# Altium project mcuhardwarebased.PrjPcb
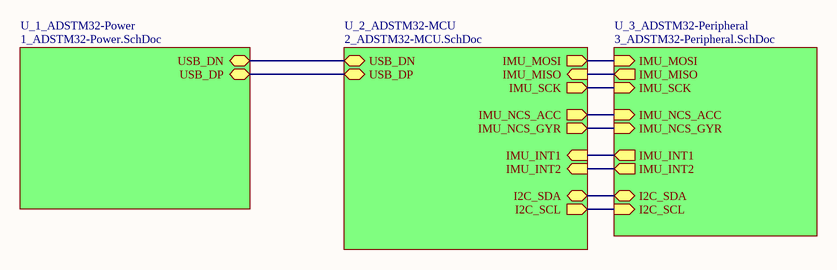
[diagram p0: 0_ADSTM32-Overview.SchDoc]
4 sheets, 30 parts. Net scope: hierarchical (ports join the sheet entries above them; power ports are global).
Board file: ADSTM32-PCB.PcbDoc
Sheets:
  0_ADSTM32-Overview.SchDoc
    U_1_ADSTM32-Power = 1_ADSTM32-Power.SchDoc
    U_2_ADSTM32-MCU = 2_ADSTM32-MCU.SchDoc
    U_3_ADSTM32-Peripheral = 3_ADSTM32-Peripheral.SchDoc

## Sheet 0_ADSTM32-Overview.SchDoc
size A; SheetNumber: 1; SheetTotal: 4

### Sub-sheets
U_1_ADSTM32-Power = 1_ADSTM32-Power.SchDoc: USB_DP (bidir), USB_DN (bidir)
U_2_ADSTM32-MCU = 2_ADSTM32-MCU.SchDoc: USB_DN (bidir), USB_DP (bidir), IMU_MISO (in), IMU_SCK (out), IMU_MOSI (out), IMU_NCS_ACC (out), IMU_NCS_GYR (out), I2C_SCL (out), I2C_SDA (bidir), IMU_INT1 (in), IMU_INT2 (in)
U_3_ADSTM32-Peripheral = 3_ADSTM32-Peripheral.SchDoc: IMU_MISO (out), IMU_SCK (in), IMU_MOSI (in), IMU_NCS_ACC (in), IMU_NCS_GYR (in), IMU_INT1 (out), IMU_INT2 (out), I2C_SCL (in), I2C_SDA (bidir)

### Nets
I2C_SCL: sheet U_2_ADSTM32-MCU/I2C_SCL, sheet U_3_ADSTM32-Peripheral/I2C_SCL
I2C_SDA: sheet U_2_ADSTM32-MCU/I2C_SDA, sheet U_3_ADSTM32-Peripheral/I2C_SDA
IMU_INT1: sheet U_2_ADSTM32-MCU/IMU_INT1, sheet U_3_ADSTM32-Peripheral/IMU_INT1
IMU_INT2: sheet U_2_ADSTM32-MCU/IMU_INT2, sheet U_3_ADSTM32-Peripheral/IMU_INT2
IMU_MISO: sheet U_2_ADSTM32-MCU/IMU_MISO, sheet U_3_ADSTM32-Peripheral/IMU_MISO
IMU_MOSI: sheet U_2_ADSTM32-MCU/IMU_MOSI, sheet U_3_ADSTM32-Peripheral/IMU_MOSI
IMU_NCS_ACC: sheet U_2_ADSTM32-MCU/IMU_NCS_ACC, sheet U_3_ADSTM32-Peripheral/IMU_NCS_ACC
IMU_NCS_GYR: sheet U_2_ADSTM32-MCU/IMU_NCS_GYR, sheet U_3_ADSTM32-Peripheral/IMU_NCS_GYR
IMU_SCK: sheet U_2_ADSTM32-MCU/IMU_SCK, sheet U_3_ADSTM32-Peripheral/IMU_SCK
USB_DN: sheet U_1_ADSTM32-Power/USB_DN, sheet U_2_ADSTM32-MCU/USB_DN
USB_DP: sheet U_1_ADSTM32-Power/USB_DP, sheet U_2_ADSTM32-MCU/USB_DP

## Sheet 1_ADSTM32-Power.SchDoc
size A; SheetNumber: 2; SheetTotal: 4
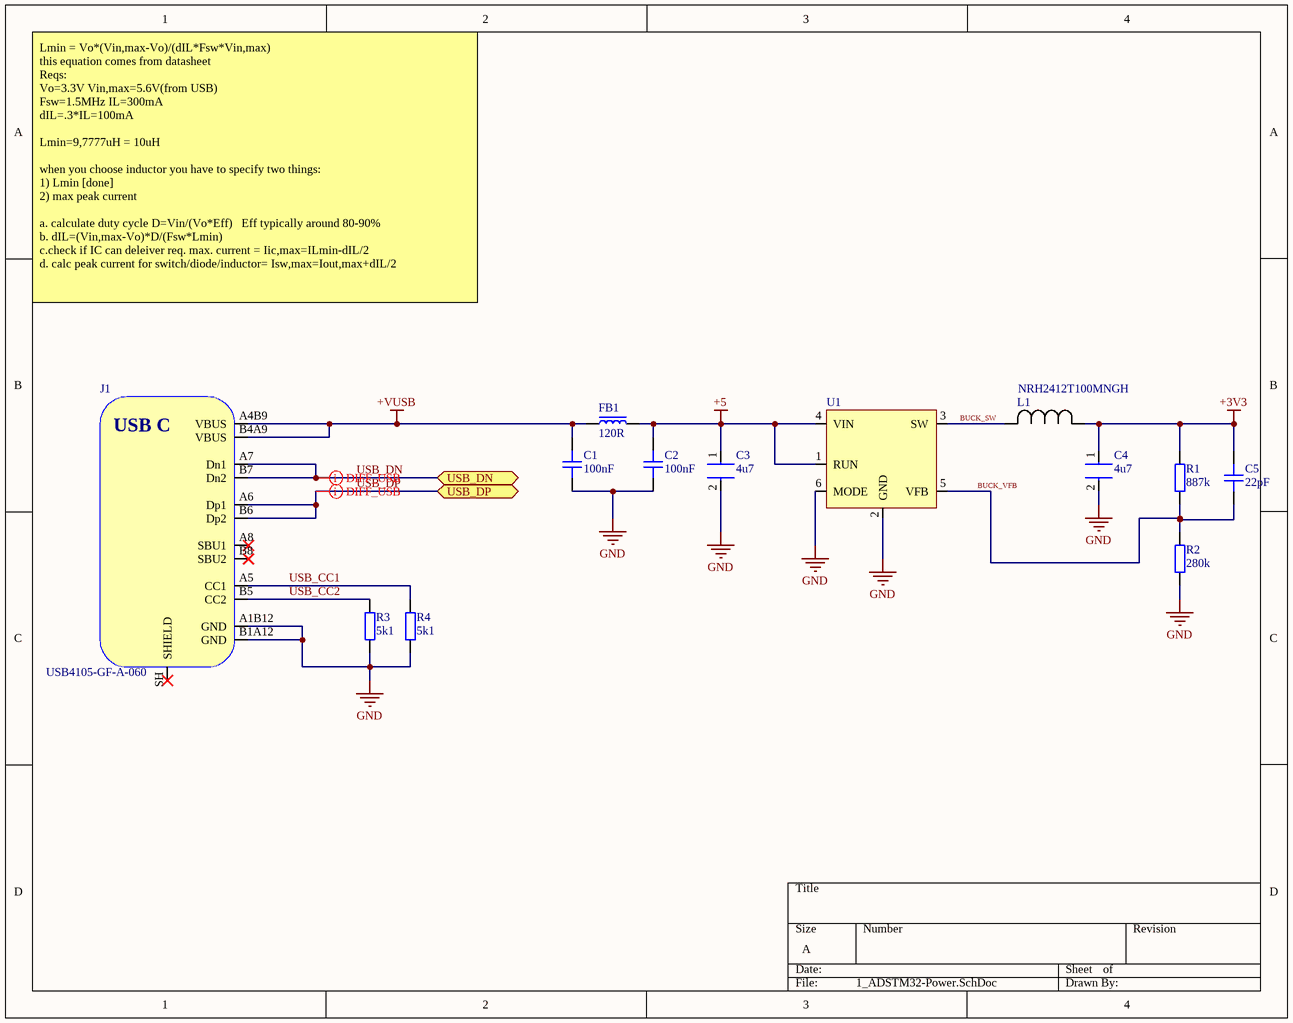
[diagram p1: 1_ADSTM32-Power.SchDoc]

### Parts
C1  100nF  [CAP_0603]
C2  100nF  [CAP_0603]
C3  4u7  [C2012X7R1C475K125AE]
C4  4u7  [C2012X7R1C475K125AE]
C5  22pF  [CAP_0603]
FB1  120R  [FB_0603]
J1  USB4105-GF-A-060  [USB4105-GF-A-060]
L1  NRH2412T100MNGH  [NRH2412T100MNGH]
R1  887k  [RES_0603]
R2  280k  [RES_0603]
R3  5k1  [RES_0603]
R4  5k1  [RES_0603]
U1  LTC3405ES6#TRMPBF  [SOT-23-6]  (value not drawn)

### Ports
USB_DN (bidir), USB_DP (bidir)

### Nets
+3V3: C4.1 C5.2 L1.1 R1.2
+5: C2.2 C3.1 FB1.2 U1.1(RUN) U1.4(VIN)
+VUSB: C1.2 FB1.1 J1.A4B9(VBUS) J1.B4A9(VBUS)
GND: C1.1 C2.1 C3.2 C4.2 J1.A1B12(GND) J1.B1A12(GND) R2.1 R3.1 R4.1 U1.2(GND) U1.6(MODE)
BUCK_SW: L1.2 U1.3(SW)
BUCK_VFB: C5.1 R1.1 R2.2 U1.5(VFB)
USB_CC1: J1.A5(CC1) R4.2
USB_CC2: J1.B5(CC2) R3.2
USB_DN: J1.A7(Dn1) J1.B7(Dn2) ; port USB_DN
USB_DP: J1.A6(Dp1) J1.B6(Dp2) ; port USB_DP

Not connected (* = marked no-connect by the designer): J1 A8(SBU1)* B8(SBU2)* SH(SHIELD)*

### Layout directives
differential pair; differential pair class DIFF_USB: USB_DN, USB_DP

### Notes on the sheet
- Lmin = Vo*(Vin,max-Vo)/(dIL*Fsw*Vin,max)
  this equation comes from datasheet
  Reqs:
  Vo=3.3V Vin,max=5.6V(from USB)
  Fsw=1.5MHz IL=300mA
  dIL=.3*IL=100mA
  Lmin=9,7777uH = 10uH
  when you choose inductor you have to specify two things:
  1) Lmin [done]
  2) max peak current
  a. calculate duty cycle D=Vin/(Vo*Eff)   Eff typically around 80-90%
  b. dIL=(Vin,max-Vo)*D/(Fsw*Lmin)
  c.check if IC can deleiver req. max. current = Iic,max=ILmin-dIL/2
  d. calc peak current for switch/diode/inductor= Isw,max=Iout,max+dIL/2
- (in symbol USB4105-GF-A-060) USB C

### Library data of the parts
C1 C2 C5 = CAP_0603: Capacitor SMD 0603; Manufacturer: *; Manufacturer Part Number: *; Distributor Link: *; LCSC: *; Rating: *; Dielectric: *
C3 C4 = CAP_0805_16V: Multilayer Ceramic Capacitors MLCC - SMD/SMT 0805 16VDC 4.7uF 10% X7R 1.25mm; Manufacturer: TDK; Manufacturer Part Number: C2012X7R1C475K125AE
FB1 = FB_0603: Ferrite Bead SMD 0603; Manufacturer: *; Manufacturer Part Number: *; Distributor Link: *; LCSC: *
J1 = USB4105-GF-A-060: USB Connector Type C SMT 12 Pin; Manufacturer: GCT; Manufacturer Part Number: USB4105-GF-A-060; Distributor Link: https://eu.mouser.com/ProductDetail/GCT/USB4105-GF-A-060?qs=QNEnbhJQKvY2mocwNJzgfA%3D%3D
L1 = NRH2412T100MNGH: Power Inductors - SMD 963-LSXNE2424MKT100M RPLCMT PN 2412 10uH 600mOhms; Manufacturer: TAIYO YUDEN; Manufacturer Part Number: NRH2412T100MNGH
R1-R4 = RES_0603: Resistor SMD 0603; Manufacturer: *; Manufacturer Part Number: *; Distributor Link: *; LCSC: *
U1 = LTC3405ES6#TRMPBF: Switching Voltage Regulators 1.5MHz, 300mA Sync Buck Reg in SOT; Manufacturer: Analog Devices; Manufacturer Part Number: LTC3405ES6#TRMPBF

## Sheet 2_ADSTM32-MCU.SchDoc
size A; SheetNumber: 3; SheetTotal: 4
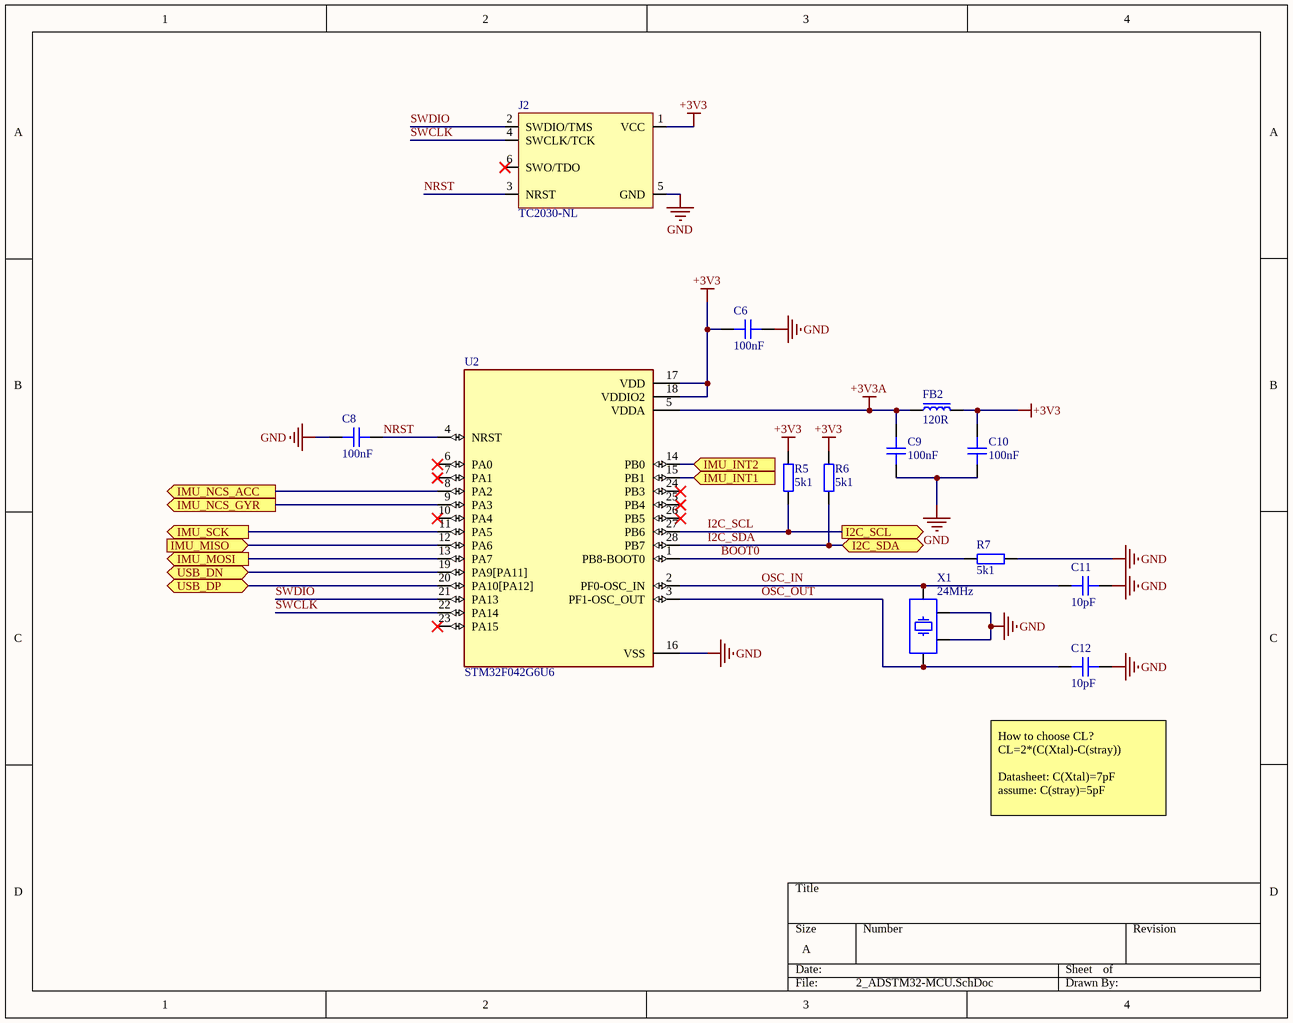
[diagram p2: 2_ADSTM32-MCU.SchDoc]

### Parts
C6  100nF  [CAP_0603]
C8  100nF  [CAP_0603]
C9  100nF  [CAP_0603]
C10  100nF  [CAP_0603]
C11  10pF  [CAP_0603]
C12  10pF  [CAP_0603]
FB2  120R  [FB_0603]
J2  TC2030-NL  [TC2030-NL-FP]  (no BOM)
R5  5k1  [RES_0603]
R6  5k1  [RES_0603]
R7  5k1  [RES_0603]
U2  STM32F042G6U6  [STM32F042G6U6]
X1  24MHz  [XTAL_3225]

### Ports
I2C_SCL (out), I2C_SDA (bidir), IMU_INT1 (in), IMU_INT2 (in), IMU_MISO (in), IMU_MOSI (out), IMU_NCS_ACC (out), IMU_NCS_GYR (out), IMU_SCK (out), USB_DN (bidir), USB_DP (bidir)

### Nets
+3V3: C6.2 C10.2 FB2.2 J2.1(VCC) R5.2 R6.2 U2.17(VDD) U2.18(VDDIO2)
+3V3A: C9.2 FB2.1 U2.5(VDDA)
GND: C6.1 C8.2 C9.1 C10.1 C11.1 C12.1 J2.5(GND) R7.1 U2.16(VSS) X1.2 X1.4
BOOT0: R7.2 U2.1(PB8-BOOT0)
I2C_SCL: R5.1 U2.27(PB6) ; port I2C_SCL
I2C_SDA: R6.1 U2.28(PB7) ; port I2C_SDA
IMU_INT1: U2.15(PB1) ; port IMU_INT1
IMU_INT2: U2.14(PB0) ; port IMU_INT2
IMU_MISO: U2.12(PA6) ; port IMU_MISO
IMU_MOSI: U2.13(PA7) ; port IMU_MOSI
IMU_NCS_ACC: U2.8(PA2) ; port IMU_NCS_ACC
IMU_NCS_GYR: U2.9(PA3) ; port IMU_NCS_GYR
IMU_SCK: U2.11(PA5) ; port IMU_SCK
NRST: C8.1 J2.3(NRST) U2.4(NRST)
OSC_IN: C11.2 U2.2(PF0-OSC_IN) X1.3
OSC_OUT: C12.2 U2.3(PF1-OSC_OUT) X1.1
SWCLK: J2.4(SWCLK/TCK) U2.22(PA14)
SWDIO: J2.2(SWDIO/TMS) U2.21(PA13)
USB_DN: U2.19(PA9[PA11]) ; port USB_DN
USB_DP: U2.20(PA10[PA12]) ; port USB_DP

Not connected (* = marked no-connect by the designer): J2 6(SWO/TDO)*; U2 6(PA0)* 7(PA1)* 10(PA4)* 23(PA15)* 24(PB3)* 25(PB4)* 26(PB5)*

### Notes on the sheet
- How to choose CL?
  CL=2*(C(Xtal)-C(stray))
  Datasheet: C(Xtal)=7pF
  assume: C(stray)=5pF

### Library data of the parts
C6 C8-C12 = CAP_0603: Capacitor SMD 0603; Manufacturer: *; Manufacturer Part Number: *; Distributor Link: *; LCSC: *; Rating: *; Dielectric: *
FB2 = FB_0603: Ferrite Bead SMD 0603; Manufacturer: *; Manufacturer Part Number: *; Distributor Link: *; LCSC: *
J2 = TC2030-NL: Tag-Connect No-Solder SWD Debug Connector (No Legs) DO NOT PLACE; Manufacturer: Tag-Connect; Manufacturer Part Number: TC2030-NL-FP
R5-R7 = RES_0603: Resistor SMD 0603; Manufacturer: *; Manufacturer Part Number: *; Distributor Link: *; LCSC: *
U2 = STM32F042G6U6: ARM® Cortex®-M0 STM32F0 Microcontroller IC 32-Bit Single-Core 48MHz 32KB (32K x 8) FLASH 28-UFQFPN (4x4); Manufacturer: STMicroelectronics; Manufacturer Part Number: STM32F042G6U6
X1 = TSX-3225_24.0000MF15X-AC: Crystal SMD 24MHz 10PPM 7pF 3225; Manufacturer: Epson; Manufacturer Part Number: TSX-3225 24.0000MF15X-AC

## Sheet 3_ADSTM32-Peripheral.SchDoc
size A; SheetNumber: 4; SheetTotal: 4
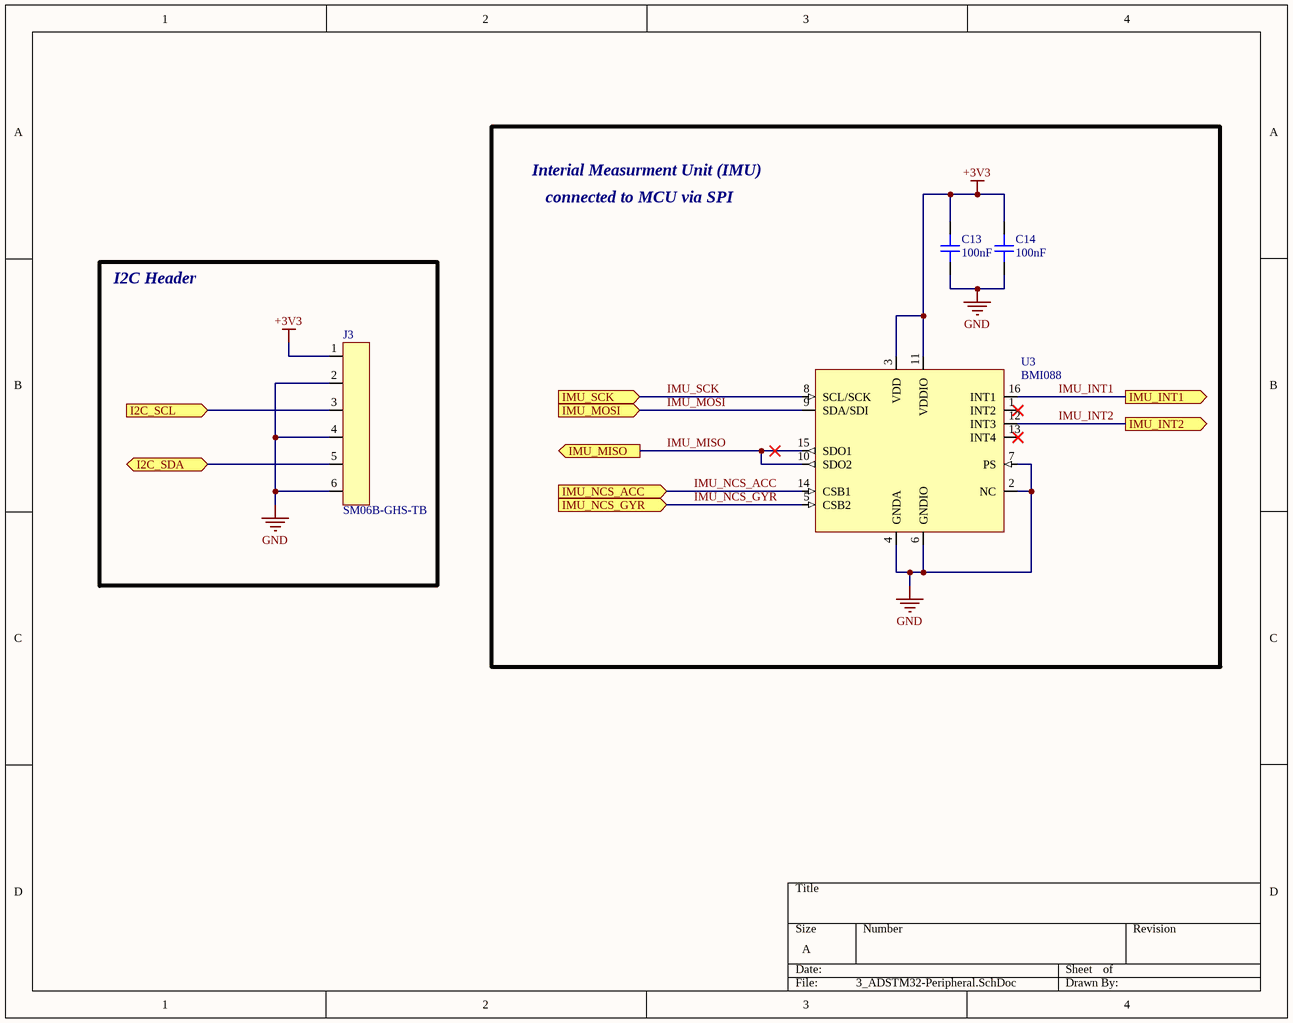
[diagram p3: 3_ADSTM32-Peripheral.SchDoc]

### Parts
C13  100nF  [CAP_0603]
C14  100nF  [CAP_0603]
J3  SM06B-GHS-TB  [SM06B-GHS-TB]
U3  BMI088  [BMI088]

### Blocks framed on the sheet
I2C Header: J3

### Ports
I2C_SCL (in), I2C_SDA (bidir), IMU_INT1 (out), IMU_INT2 (out), IMU_MISO (out), IMU_MOSI (in), IMU_NCS_ACC (in), IMU_NCS_GYR (in), IMU_SCK (in)

### Nets
+3V3: C13.2 C14.2 J3.1 U3.3(VDD) U3.11(VDDIO)
GND: C13.1 C14.1 J3.2 J3.4 J3.6 U3.2(NC) U3.4(GNDA) U3.6(GNDIO) U3.7(PS)
I2C_SCL: J3.3 ; port I2C_SCL
I2C_SDA: J3.5 ; port I2C_SDA
IMU_INT1: U3.16(INT1) ; port IMU_INT1
IMU_INT2: U3.12(INT3) ; port IMU_INT2
IMU_MISO: U3.10(SDO2) U3.15(SDO1) ; port IMU_MISO
IMU_MOSI: U3.9(SDA/SDI) ; port IMU_MOSI
IMU_NCS_ACC: U3.14(CSB1) ; port IMU_NCS_ACC
IMU_NCS_GYR: U3.5(CSB2) ; port IMU_NCS_GYR
IMU_SCK: U3.8(SCL/SCK) ; port IMU_SCK

Not connected (* = marked no-connect by the designer): U3 1(INT2)* 13(INT4)*

### Notes on the sheet
- Interial Measurment Unit (IMU)
- connected to MCU via SPI

### Library data of the parts
C13 C14 = CAP_0603: Capacitor SMD 0603; Manufacturer: *; Manufacturer Part Number: *; Distributor Link: *; LCSC: *; Rating: *; Dielectric: *
J3 = SM06B-GHS-TB: Header Connector 6 Position 1.25MM Pitch SMD Horizontal JST GH; Manufacturer: JST; Manufacturer Part Number: SM06B-GHS-TB
U3 = BMI088: Inertial Measurement Unit IMU 6-Axis LGA; Manufacturer: Bosch; Manufacturer Part Number: BMI088

## Nets that join several sheets
+3V3: 1_ADSTM32-Power (C4.1 C5.2 L1.1 R1.2), 2_ADSTM32-MCU (8 pins), 3_ADSTM32-Peripheral (5 pins)
GND: 1_ADSTM32-Power (11 pins), 2_ADSTM32-MCU (11 pins), 3_ADSTM32-Peripheral (9 pins)
I2C_SCL: 2_ADSTM32-MCU (R5.1 U2.27), 3_ADSTM32-Peripheral (J3.3)
I2C_SDA: 2_ADSTM32-MCU (R6.1 U2.28), 3_ADSTM32-Peripheral (J3.5)
IMU_INT1: 2_ADSTM32-MCU (U2.15), 3_ADSTM32-Peripheral (U3.16)
IMU_INT2: 2_ADSTM32-MCU (U2.14), 3_ADSTM32-Peripheral (U3.12)
IMU_MISO: 2_ADSTM32-MCU (U2.12), 3_ADSTM32-Peripheral (U3.10 U3.15)
IMU_MOSI: 2_ADSTM32-MCU (U2.13), 3_ADSTM32-Peripheral (U3.9)
IMU_NCS_ACC: 2_ADSTM32-MCU (U2.8), 3_ADSTM32-Peripheral (U3.14)
IMU_NCS_GYR: 2_ADSTM32-MCU (U2.9), 3_ADSTM32-Peripheral (U3.5)
IMU_SCK: 2_ADSTM32-MCU (U2.11), 3_ADSTM32-Peripheral (U3.8)
USB_DN: 1_ADSTM32-Power (J1.A7 J1.B7), 2_ADSTM32-MCU (U2.19)
USB_DP: 1_ADSTM32-Power (J1.A6 J1.B6), 2_ADSTM32-MCU (U2.20)